# Altium schematic sheet ScintillatorCircuit.SchDoc
size A4; SheetNumber: 3; SheetTotal: 3
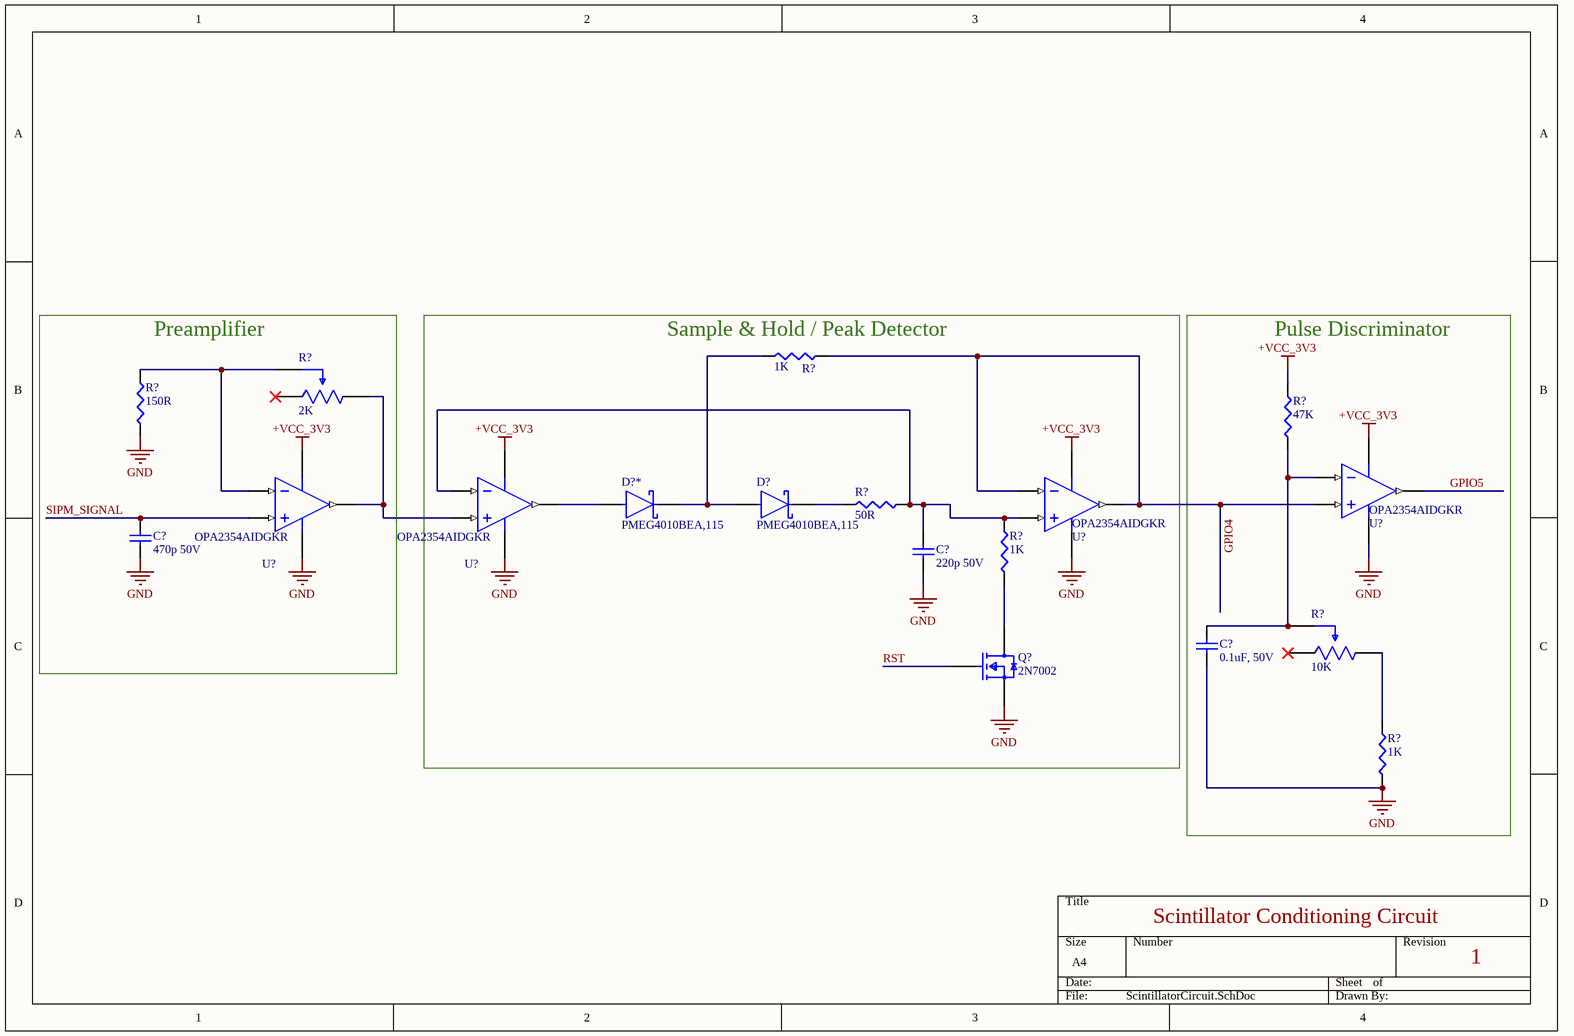
[diagram p0: ScintillatorCircuit.SchDoc]

## Parts
(Parts that share a designator on the sheet are numbered #1, #2 ... from top to bottom, then left to right.)
C?#1  470p 50V
C?#2  220p 50V
C?#3  0.1uF, 50V
D?  PMEG4010BEA,115
D?*  PMEG4010BEA,115
Q?  2N7002
R?#1  1K
R?#2  2K
R?#3  150R
R?#4  47K
R?#5  50R
R?#6  1K
R?#7  10K
R?#8  1K
U?#1  OPA2354AIDGKR
U?#2  OPA2354AIDGKR
U?#3  OPA2354AIDGKR
U?#4  OPA2354AIDGKR

## Blocks framed on the sheet
Preamplifier: C?#1 R?#2 R?#3 U?#2
Sample & Hold / Peak Detector: C?#2 D? D?* Q? R?#1 R?#5 R?#6 U?#3 U?#4
Pulse Discriminator: C?#3 R?#4 R?#7 R?#8 U?#1

## Nets
+VCC_3V3: R?#4.2 U?#1.8(V+) U?#2.8(V+) U?#3.8(V+) U?#4.8(V+)
GND: C?#1.1 C?#2.1 C?#3.1 Q?.2(S) R?#3.1 R?#8.1 U?#1.4(V-) U?#2.4(V-) U?#3.4(V-) U?#4.4(V-)
GPIO4: R?#1.2 U?#1.3(IN_A+) U?#4.1(OUT_A) U?#4.2(IN_A-)
GPIO5: U?#1.1(OUT_A)
RST: Q?.1(G)
SIPM_SIGNAL: C?#1.2 U?#2.3(IN_A+)
NetC?#2_2: C?#2.2 R?#5.2 R?#6.2 U?#3.2(IN_A-) U?#4.3(IN_A+)
NetC?#3_2: C?#3.2 R?#4.1 R?#7.2(WIPER) U?#1.2(IN_A-)
NetD?*_2: D?*.2(A) U?#3.1(OUT_A)
NetD?_1: D?.1(C) R?#5.1
NetD?_2: D?.2(A) D?*.1(C) R?#1.1
NetQ?_3: Q?.3(D) R?#6.1
NetR?#2_2: R?#2.2(WIPER) R?#3.2 U?#2.2(IN_A-)
NetR?#2_3: R?#2.3(CW) U?#2.1(OUT_A) U?#3.3(IN_A+)
NetR?#7_3: R?#7.3(CW) R?#8.2

Not connected (* = marked no-connect by the designer): R?#2 1(CCW)*; R?#7 1(CCW)*

## Notes on the sheet
- Scintillator Conditioning Circuit
- 1

## Library data of the parts
C?#1 = CL05B471KB5VPNC: CAP CER 470PF 50V X7R 0402; Manufacturer: Samsung; Dielectric Material: Ceramic; Multilayer: Yes; Tolerance  (fill in as +-): 10%; Reference Standard: AEC-Q200; Supplier: Digikey; Supplier Part Number: 1276-6586-1-ND; Manufacturer Part Number: CL05B471KB5VPNC; RoHS: Yes; Category: Ceramic Capacitors; Stock: 5716; Pricing: 1=0,1, 10=0,031, 100=0,0179, 1000=0,01119, 2500=0,00885, 5000=0,00853 (USD); Mounting Technology: Surface Mount; Pins: 2; Package Shape: Rectangular; Case/Package: 0402; Terminal Finish: Nickel; Min Operating Temperature: -55°C; Max Operating Temperature: 125°C; JESD-609 Code: e3; Value: 470pF; Capacitor Type: Ceramic; Packaging: Tape and Reel; Tolerance (fill in as +-): 10%; Rated DC Voltage (URdc): 50V; Temperature Characteristics Code: X7R; Termination: Wraparound; Reach SVHC Compliant: Yes; RoHS Compliant: Yes; ComponentLink1URL: https://datasheet.ciiva.com:443/pdfs/VipMasterIC/IC/SEMS/SEMS-S-A0005596039/SEMS-S-A0005588397-1.pdf?src-supplier=IHS+Markit; ComponentLink1Description: https://datasheet.ciiva.com:443/pdfs/VipMasterIC/IC/SEMS/SEMS-S-A0005596039/SEMS-S-A0005588397-1.pdf?src-supplier=IHS+Markit; ComponentLink2URL: http://www.samsungsem.com/kr/support/product-search/mlcc/CL05B471KB5VPNC.jsp?src-supplier=Digikey; ComponentLink2Description: http://www.samsungsem.com/kr/support/product-search/mlcc/CL05B471KB5VPNC.jsp?src-supplier=Digikey; ComponentLink3URL: http://www.samsungsem.com/servlet/FileDownload?type=spec&file=CL05B471KB5VPNC.pdf&src-supplier=Avnet; ComponentLink3Description: http://www.samsungsem.com/servlet/FileDownload?type=spec&file=CL05B471KB5VPNC.pdf&src-supplier=Avnet; ComponentLink4URL: https://datasheet.octopart.com/CL05B471KB5VPNC-Samsung-Electro-Mechanics-datasheet-110326788.pdf?src-supplier=Future+Electronics; ComponentLink4Description: https://datasheet.octopart.com/CL05B471KB5VPNC-Samsung-Electro-Mechanics-datasheet-110326788.pdf?src-supplier=Future+Electronics; LCSC Part Number: C472438
C?#2 = CL05B221KB5NNNC: CAP CER 220PF 50V X7R 0402; Manufacturer: Samsung; Dielectric Material: Ceramic; Multilayer: Yes; Tolerance  (fill in as +-): 10%; Supplier: Digikey; Supplier Part Number: 1276-1531-1-ND; Manufacturer Part Number: CL05B221KB5NNNC; RoHS: Yes; Category: Ceramic Capacitors; Stock: 59270; Pricing: 1=0,1, 10=0,019, 100=0,0104, 1000=0,00621, 2500=0,00466, 5000=0,00442 (USD); Mounting Technology: Surface Mount; Pins: 2; Package Shape: Rectangular; Case/Package: 0402; Terminal Finish: Nickel; Min Operating Temperature: -55°C; Max Operating Temperature: 125°C; JESD-609 Code: e3; Value: 220pF; Capacitor Type: Ceramic; Package Style: SMTMeter; Packaging: Tape and Reel; Tolerance (fill in as +-): 10%; Rated DC Voltage (URdc): 50V; Temperature Characteristics Code: X7R; Termination: Wraparound; Length: 1mm; Width: 0.5mm; Height: 0.55mm; Reach SVHC Compliant: Yes; RoHS Compliant: Yes; ComponentLink1URL: https://datasheet.ciiva.com:443/pdfs/VipMasterIC/IC/SEMS/SEMS-S-A0008384515/SEMS-S-A0008872887-1.pdf?src-supplier=IHS+Markit; ComponentLink1Description: https://datasheet.ciiva.com:443/pdfs/VipMasterIC/IC/SEMS/SEMS-S-A0008384515/SEMS-S-A0008872887-1.pdf?src-supplier=IHS+Markit; ComponentLink2URL: https://datasheet.ciiva.com/25806/cl05b221kb5nnnc-25806724.pdf?src-supplier=Digikey; ComponentLink2Description: https://datasheet.ciiva.com/25806/cl05b221kb5nnnc-25806724.pdf?src-supplier=Digikey; ComponentLink3URL: https://datasheet.ciiva.com/26838/getdatasheetpartid-359684-26838219.pdf?src-supplier=Verical; ComponentLink3Description: https://datasheet.ciiva.com/26838/getdatasheetpartid-359684-26838219.pdf?src-supplier=Verical; ComponentLink4URL: https://datasheet.ciiva.com/16449/cl05b221kb5nnnc-16449133.pdf?src-supplier=Future+Electronics; ComponentLink4Description: https://datasheet.ciiva.com/16449/cl05b221kb5nnnc-16449133.pdf?src-supplier=Future+Electronics; ComponentLink5URL: https://datasheet.ciiva.com/26309/mlcc-catalogdownload2013-eng-26309018.pdf?src-supplier=Distrelec; ComponentLink5Description: https://datasheet.ciiva.com/26309/mlcc-catalogdownload2013-eng-26309018.pdf?src-supplier=Distrelec; LCSC Part Number: C296710
C?#3 = CL05B104KB5NNNC: CAP CER 0.1UF 50V X7R 0402; Manufacturer: Samsung; Dielectric Material: Ceramic; Value: 100nF; Multilayer: Yes; Tolerance  (fill in as +-): 10%; Supplier: Avnet; Supplier Part Number: CL05B104KB5NNNC; Manufacturer Part Number: CL05B104KB5NNNC; RoHS: Yes; Category: Ceramic Capacitors; Pricing: 100000=0,00598, 120000=0,00595, 220000=0,00592, 500000=0,00589, 1000000=0,00586 (USD); Mounting Technology: Surface Mount; Pins: 2; Package Shape: Rectangular; Case/Package: 0402; Terminal Finish: Nickel; Min Operating Temperature: -55°C; Max Operating Temperature: 125°C; JESD-609 Code: e3; Capacitor Type: Ceramic; Packaging: Tape and Reel; Tolerance (fill in as +-): 10%; Rated DC Voltage (URdc): 50V; Temperature Characteristics Code: X7R; Termination: Wraparound; Reach SVHC Compliant: Yes; RoHS Compliant: Yes; ComponentLink1URL: https://datasheet.ciiva.com:443/pdfs/VipMasterIC/IC/SEMS/SEMS-S-A0008523115/SEMS-S-A0008523176-1.pdf?src-supplier=IHS+Markit; ComponentLink1Description: https://datasheet.ciiva.com:443/pdfs/VipMasterIC/IC/SEMS/SEMS-S-A0008523115/SEMS-S-A0008523176-1.pdf?src-supplier=IHS+Markit; ComponentLink2URL: https://datasheet.octopart.com/CL05B104KB5NNNC-Samsung-datasheet-97040617.pdf?src-supplier=Future+Electronics; ComponentLink2Description: https://datasheet.octopart.com/CL05B104KB5NNNC-Samsung-datasheet-97040617.pdf?src-supplier=Future+Electronics; ComponentLink3URL: https://datasheet.octopart.com/CL05B104KB5NNNC-Samsung-datasheet-8326407.pdf?src-supplier=TME; ComponentLink3Description: https://datasheet.octopart.com/CL05B104KB5NNNC-Samsung-datasheet-8326407.pdf?src-supplier=TME; LCSC Part Number: C960916
D? D?* = PMEG4010BEA,115: DIODE SCHOTTKY 40V 1A SOD323; Manufacturer: Nexperia; Diode Element Material: SILICON; Package Body Material: Plastic; Diode Type: RECTIFIER; Number of Elements: 1; Time @ Peak Reflow Temperature-Max (s): 40s; Qualification Status: Not Qualified; Supplier: Digikey; Supplier Part Number: 1727-5211-1-ND; Manufacturer Part Number: PMEG4010BEA,115; RoHS: Yes; Category: Schottky Diodes; Stock: 84260; Pricing: 1=0,29, 10=0,171, 100=0,109, 500=0,09678, 1000=0,08581 (USD); Pins: 2; Package Shape: Rectangular; Terminal Finish: Tin; Max Operating Temperature: 150°C; JESD-609 Code: e3; JESD-30 Code: R-PDSO-G2; Moisture Sensitivity Level: 1; Max Output current: 1A; Package Style: SMALL OUTLINEMeter; Peak Reflow Temperature (Cel): 260°C; Surface Mount: Yes; Technology: SCHOTTKY; Terminal Form: Gull Wing; Terminal Position: DUAL; Reach SVHC Compliant: Yes; RoHS Compliant: Yes; ComponentLink1URL: https://datasheet.ciiva.com:443/pdfs/VipMasterIC/IC/PHGL/PHGLS19535/PHGLS19689-1.pdf?src-supplier=IHS+Markit; ComponentLink1Description: https://datasheet.ciiva.com:443/pdfs/VipMasterIC/IC/PHGL/PHGLS19535/PHGLS19689-1.pdf?src-supplier=IHS+Markit; ComponentLink2URL: http://www.farnell.com/datasheets/689588.pdf?src-supplier=Farnell; ComponentLink2Description: http://www.farnell.com/datasheets/689588.pdf?src-supplier=Farnell; ComponentLink3URL: https://datasheet.octopart.com/PMEG4010BEA%2C115-Nexperia-datasheet-142110124.pdf?src-supplier=Future+Electronics; ComponentLink3Description: https://datasheet.octopart.com/PMEG4010BEA%2C115-Nexperia-datasheet-142110124.pdf?src-supplier=Future+Electronics; ComponentLink4URL: https://datasheet.octopart.com/PMEG4010BEA%2C115-Nexperia-datasheet-180924740.pdf?src-supplier=Newark; ComponentLink4Description: https://datasheet.octopart.com/PMEG4010BEA%2C115-Nexperia-datasheet-180924740.pdf?src-supplier=Newark; LCSC Part Number: C36975
Q? = 2N7002: MOSFET SOT23 N 60V 5OHM 150C; Manufacturer: ON Semiconductor / Fairchild; Package Body Material: Plastic; Transistor Element Material: SILICON; Polarity/Channel Type: N-CHANNEL; Drain Current-Max (ID): 115mA; Drain-source On Resistance-Max: 7.5R; Feedback Cap-Max (Crss): 5pF; FET Technology: METAL-OXIDE SEMICONDUCTOR; Number of Elements: 1; Operating Mode: ENHANCEMENT MODE; Power Dissipation-Max (Abs): 200mW; Transistor Application: SWITCHING; Qualification Status: Not Qualified; JEDEC-95 Code: TO-236AB; Supplier: Digikey; Supplier Part Number: 2N7002NCT-ND; Manufacturer Part Number: 2N7002; RoHS: Yes; Category: MOSFETs; Stock: 13333; Pricing: 1=0,49, 10=0,285, 100=0,1683, 500=0,16466, 1000=0,15124 (USD); Pins: 3; Package Shape: Rectangular; Terminal Finish: Tin; Max Operating Temperature: 150°C; JESD-609 Code: e3; DS Breakdown Voltage-Min: 60V; JESD-30 Code: R-PDSO-G3; Package Style: SMALL OUTLINEMeter; Surface Mount: Yes; Terminal Form: Gull Wing; Terminal Position: DUAL; Drain Current-Max (Abs) (ID): 115mA; Moisture Sensitivity Level: 1; RoHS Compliant: Yes; Reach SVHC Compliant: Yes; ComponentLink1URL: https://datasheet.ciiva.com:443/pdfs/VipMasterIC/IC/ONSM/ONSM-S-A0003544006/ONSM-S-A0003544006-1.pdf?src-supplier=IHS+Markit; ComponentLink1Description: https://datasheet.ciiva.com:443/pdfs/VipMasterIC/IC/ONSM/ONSM-S-A0003544006/ONSM-S-A0003544006-1.pdf?src-supplier=IHS+Markit; ComponentLink2URL: https://datasheet.ciiva.com/931/2n7000-931777.pdf?src-supplier=Farnell; ComponentLink2Description: https://datasheet.ciiva.com/931/2n7000-931777.pdf?src-supplier=Farnell; ComponentLink3URL: https://datasheet.ciiva.com/1254/2n7002-1254451.pdf?src-supplier=Newark; ComponentLink3Description: https://datasheet.ciiva.com/1254/2n7002-1254451.pdf?src-supplier=Newark; ComponentLink4URL: https://datasheet.ciiva.com/15137/getdatasheetpartid-93547-15137771.pdf?src-supplier=Verical; ComponentLink4Description: https://datasheet.ciiva.com/15137/getdatasheetpartid-93547-15137771.pdf?src-supplier=Verical; ComponentLink5URL: https://datasheet.ciiva.com/931/2n7000-931763.pdf?src-supplier=Digikey; ComponentLink5Description: https://datasheet.ciiva.com/931/2n7000-931763.pdf?src-supplier=Digikey; ComponentLink6URL: https://datasheet.ciiva.com/3304/nds7002a-3304381.pdf?src-supplier=Avnet; ComponentLink6Description: https://datasheet.ciiva.com/3304/nds7002a-3304381.pdf?src-supplier=Avnet; ComponentLink7URL: https://datasheet.ciiva.com/1188/660093-1188361.pdf?src-supplier=Element14; ComponentLink7Description: https://datasheet.ciiva.com/1188/660093-1188361.pdf?src-supplier=Element14; ComponentLink8URL: https://datasheet.ciiva.com/931/2n7000-931762.pdf?src-supplier=Digikey; ComponentLink8Description: https://datasheet.ciiva.com/931/2n7000-931762.pdf?src-supplier=Digikey; ComponentLink9URL: https://datasheet.ciiva.com/1254/660093-1254452.pdf?src-supplier=Newark; ComponentLink9Description: https://datasheet.ciiva.com/1254/660093-1254452.pdf?src-supplier=Newark; ComponentLink10URL: https://datasheet.ciiva.com/17007/2n7002-17007243.pdf?src-supplier=Future+Electronics; ComponentLink10Description: https://datasheet.ciiva.com/17007/2n7002-17007243.pdf?src-supplier=Future+Electronics; ComponentLink11URL: https://datasheet.ciiva.com/22655/660093-22655230.pdf?src-supplier=Element14; ComponentLink11Description: https://datasheet.ciiva.com/22655/660093-22655230.pdf?src-supplier=Element14; LCSC Part Number: C124475
R?#1 R?#6 R?#8 = AC0402JR-071KL: RES SMD 1K OHM 5% 1/16W 0402; Manufacturer: Yageo; Additional Feature: LASER TRIMMABLE; Power: 62.5mW; Rated Temperature: 70°C; Value: 1kR; Working Voltage: 50V; Temperature Coefficient (ppm/Cel): 100; Package Height: 0.32mm; Package Length: 1mm; Package Width: 0.5mm; Reference Standard: AEC-Q200; Supplier: Digikey; Supplier Part Number: YAG3525CT-ND; Manufacturer Part Number: AC0402JR-071KL; RoHS: Yes; Category: Chip SMD Resistors; Stock: 135341; Pricing: 1=0,1, 10=0,007, 50=0,0066, 100=0,0061, 500=0,0051, 1000=0,00408 (USD); Mounting Technology: Surface Mount; Pins: 2; Package Shape: Rectangular; Case/Package: 0402; Terminal Finish: Nickel; Min Operating Temperature: -55°C; Max Operating Temperature: 155°C; Tolerance: 5%; JESD-609 Code: e3; Termination: Wraparound; Resistor Type: FIXED RESISTOR; Construction: Chip; Packaging: Tape and Reel; Technology: METAL GLAZE/THICK FILM; Reach SVHC Compliant: Yes; RoHS Compliant: Yes; ComponentLink1URL: https://datasheet.ciiva.com:443/pdfs/VipMasterIC/IC/YAGO/YAGO-S-A0003597364/YAGO-S-A0003597364-1.pdf?src-supplier=IHS+Markit; ComponentLink1Description: https://datasheet.ciiva.com:443/pdfs/VipMasterIC/IC/YAGO/YAGO-S-A0003597364/YAGO-S-A0003597364-1.pdf?src-supplier=IHS+Markit; ComponentLink2URL: https://datasheet.ciiva.com/12577/pyu-ac-51-rohs-l-2-12577195.pdf?src-supplier=Mouser; ComponentLink2Description: https://datasheet.ciiva.com/12577/pyu-ac-51-rohs-l-2-12577195.pdf?src-supplier=Mouser; LCSC Part Number: C138287
R?#2 = 3314J-1-202E: TRIMMER 2K OHM 0.25W J LEAD TOP; Manufacturer: Bourns; Tolerance: 20%; Actuator Orientation: Vertical; Actuator Type: SCREW; Number of Turns: 1; Power: 250mW; Rated Temperature: 70°C; Value: 2kR; Resistance Law: Linear; Rotational Angle: 240°; Temperature Coefficient (ppm/Cel): -100,100; Package Height: 2.55mm; Package Length: 5mm; Package Width: 4.5mm; Supplier: Digikey; Supplier Part Number: 3314J-202ECT-ND; Manufacturer Part Number: 3314J-1-202E; RoHS: Yes; Category: Variable Resistors and Potentiometers; Stock: 7573; Pricing: 1=1,58, 10=1,335, 100=1,1219 (USD); Mounting Technology: Surface Mount; Pins: 3; Package Shape: Rectangular; Case/Package: 2018; Terminal Finish: Tin; Min Operating Temperature: -55°C; Max Operating Temperature: 125°C; JESD-609 Code: e3; Resistor Type: TRIMMER; Construction: Rectangular; Packaging: Tape and Reel; Technology: CERMET; Termination: J BEND; Reach SVHC Compliant: Yes; RoHS Compliant: Yes; ComponentLink1URL: https://datasheet.ciiva.com:443/pdfs/VipMasterIC/IC/BOUR/BOUR-S-A0008818047/BOUR-S-A0008818047-1.pdf?src-supplier=IHS+Markit; ComponentLink1Description: https://datasheet.ciiva.com:443/pdfs/VipMasterIC/IC/BOUR/BOUR-S-A0008818047/BOUR-S-A0008818047-1.pdf?src-supplier=IHS+Markit; ComponentLink2URL: https://datasheet.ciiva.com/6197/1770665-6197457.pdf?src-supplier=Farnell; ComponentLink2Description: https://datasheet.ciiva.com/6197/1770665-6197457.pdf?src-supplier=Farnell; ComponentLink3URL: https://datasheet.ciiva.com/11831/0900766b800302ec-11831929.pdf?src-supplier=Rs; ComponentLink3Description: https://datasheet.ciiva.com/11831/0900766b800302ec-11831929.pdf?src-supplier=Rs; ComponentLink4URL: https://datasheet.ciiva.com/2156/3314-2156300.pdf?src-supplier=Digikey; ComponentLink4Description: https://datasheet.ciiva.com/2156/3314-2156300.pdf?src-supplier=Digikey; ComponentLink5URL: https://datasheet.ciiva.com/2156/3314-2156301.pdf?src-supplier=Digikey; ComponentLink5Description: https://datasheet.ciiva.com/2156/3314-2156301.pdf?src-supplier=Digikey; ComponentLink6URL: https://datasheet.ciiva.com/2156/3314-2156302.pdf?src-supplier=Digikey; ComponentLink6Description: https://datasheet.ciiva.com/2156/3314-2156302.pdf?src-supplier=Digikey; ComponentLink7URL: https://datasheet.ciiva.com/3266/3314-3266277.pdf?src-supplier=Avnet; ComponentLink7Description: https://datasheet.ciiva.com/3266/3314-3266277.pdf?src-supplier=Avnet; ComponentLink8URL: https://datasheet.ciiva.com/30098/6393314-30098281.pdf?src-supplier=Onlinecomponents.com; ComponentLink8Description: https://datasheet.ciiva.com/30098/6393314-30098281.pdf?src-supplier=Onlinecomponents.com; ComponentLink9URL: https://datasheet.ciiva.com/1477/1846253-1477628.pdf?src-supplier=Element14; ComponentLink9Description: https://datasheet.ciiva.com/1477/1846253-1477628.pdf?src-supplier=Element14; ComponentLink10URL: https://datasheet.ciiva.com/22696/1846253-22696687.pdf?src-supplier=Element14; ComponentLink10Description: https://datasheet.ciiva.com/22696/1846253-22696687.pdf?src-supplier=Element14; ComponentLink11URL: https://datasheet.ciiva.com/48698/001055052-da-01-en-smd-trimm-3314j-1-202e-2k-ohm-0-25w-48698971.pdf?src-supplier=Conrad; ComponentLink11Description: https://datasheet.ciiva.com/48698/001055052-da-01-en-smd-trimm-3314j-1-202e-2k-ohm-0-25w-48698971.pdf?src-supplier=Conrad; LCSC Part Number: C94513
R?#3 = AC0402FR-07150RL: RES SMD 150 OHM 1% 1/16W 0402; Manufacturer: Yageo; Additional Feature: LASER TRIMMABLE; Power: 62.5mW; Rated Temperature: 70°C; Working Voltage: 50V; Temperature Coefficient (ppm/Cel): 100; Package Height: 0.32mm; Package Length: 1mm; Package Width: 0.5mm; Reference Standard: AEC-Q200; Supplier: Digikey; Supplier Part Number: YAG3443DKR-ND; Manufacturer Part Number: AC0402FR-07150RL; Category: Chip SMD Resistors; Stock: 72156; Pricing: 1=0,1, 10=0,009, 100=0,0071, 1000=0,00612, 2500=0,0051, 5000=0,00407 (USD); Mounting Technology: Surface Mount; Pins: 2; Package Shape: Rectangular; Case/Package: 0402; Terminal Finish: Nickel; Min Operating Temperature: -55°C; Max Operating Temperature: 155°C; Tolerance: 1%; JESD-609 Code: e3; Resistor Type: FIXED RESISTOR; Construction: Chip; Packaging: Tape and Reel; Value: 150R; Technology: METAL GLAZE/THICK FILM; Termination: Wraparound; Reach SVHC Compliant: Yes; RoHS Compliant: Yes; ComponentLink1URL: https://datasheet.ciiva.com:443/pdfs/VipMasterIC/IC/YAGO/YAGO-S-A0003597364/YAGO-S-A0003597364-1.pdf?src-supplier=IHS+Markit; ComponentLink1Description: https://datasheet.ciiva.com:443/pdfs/VipMasterIC/IC/YAGO/YAGO-S-A0003597364/YAGO-S-A0003597364-1.pdf?src-supplier=IHS+Markit; ComponentLink2URL: https://datasheet.ciiva.com/12576/pyu-ac-51-rohs-l-2-12576540.pdf?src-supplier=Mouser; ComponentLink2Description: https://datasheet.ciiva.com/12576/pyu-ac-51-rohs-l-2-12576540.pdf?src-supplier=Mouser; ComponentLink3URL: https://datasheet.octopart.com/AC0402FR-07150RL-Yageo-datasheet-83209224.pdf?src-supplier=Upverter; ComponentLink3Description: https://datasheet.octopart.com/AC0402FR-07150RL-Yageo-datasheet-83209224.pdf?src-supplier=Upverter; ComponentLink4URL: https://datasheet.octopart.com/AC0402FR-07150RL-Yageo-datasheet-178509465.pdf?src-supplier=Farnell; ComponentLink4Description: https://datasheet.octopart.com/AC0402FR-07150RL-Yageo-datasheet-178509465.pdf?src-supplier=Farnell; ComponentLink5URL: https://datasheet.octopart.com/AC0402FR-07150RL-Yageo-datasheet-12512238.pdf; ComponentLink5Description: https://datasheet.octopart.com/AC0402FR-07150RL-Yageo-datasheet-12512238.pdf; ComponentLink6URL: https://datasheet.octopart.com/AC0402FR-07150RL-Yageo-datasheet-166720450.pdf?src-supplier=Future+Electronics; ComponentLink6Description: https://datasheet.octopart.com/AC0402FR-07150RL-Yageo-datasheet-166720450.pdf?src-supplier=Future+Electronics; ComponentLink7URL: https://datasheet.octopart.com/AC0402FR-07150RL-Yageo-datasheet-151884373.pdf?src-supplier=Future+Electronics; ComponentLink7Description: https://datasheet.octopart.com/AC0402FR-07150RL-Yageo-datasheet-151884373.pdf?src-supplier=Future+Electronics; ComponentLink8URL: https://datasheet.octopart.com/AC0402FR-07150RL-Yageo-datasheet-137699919.pdf?src-supplier=Future+Electronics; ComponentLink8Description: https://datasheet.octopart.com/AC0402FR-07150RL-Yageo-datasheet-137699919.pdf?src-supplier=Future+Electronics; ComponentLink9URL: https://datasheet.octopart.com/AC0402FR-07150RL-Yageo-datasheet-24580492.pdf?src-supplier=Future+Electronics; ComponentLink9Description: https://datasheet.octopart.com/AC0402FR-07150RL-Yageo-datasheet-24580492.pdf?src-supplier=Future+Electronics; ComponentLink10URL: https://datasheet.octopart.com/AC0402FR-07150RL-Yageo-datasheet-13029202.pdf?src-supplier=Future+Electronics; ComponentLink10Description: https://datasheet.octopart.com/AC0402FR-07150RL-Yageo-datasheet-13029202.pdf?src-supplier=Future+Electronics; ComponentLink11URL: https://datasheet.octopart.com/AC0402FR-07150RL-Yageo-datasheet-140571090.pdf?src-supplier=Arrow.cn; ComponentLink11Description: https://datasheet.octopart.com/AC0402FR-07150RL-Yageo-datasheet-140571090.pdf?src-supplier=Arrow.cn; LCSC Part Number: C226790
R?#4 = AC0402FR-0747KL: RES SMD 47K OHM 1% 1/16W 0402; Manufacturer: Yageo; Additional Feature: LASER TRIMMABLE; Power: 62.5mW; Rated Temperature: 70°C; Value: 47kR; Working Voltage: 50V; Temperature Coefficient (ppm/Cel): 100; Package Height: 0.32mm; Package Length: 1mm; Package Width: 0.5mm; Reference Standard: AEC-Q200; Supplier: Digikey; Supplier Part Number: YAG3490CT-ND; Manufacturer Part Number: AC0402FR-0747KL; RoHS: Yes; Category: Chip SMD Resistors; Stock: 187655; Pricing: 1=0,1, 10=0,011, 100=0,0082, 1000=0,00612, 2500=0,0051, 5000=0,00407 (USD); Mounting Technology: Surface Mount; Pins: 2; Package Shape: Rectangular; Case/Package: 0402; Terminal Finish: Nickel; Min Operating Temperature: -55°C; Max Operating Temperature: 155°C; Tolerance: 1%; JESD-609 Code: e3; Resistor Type: FIXED RESISTOR; Construction: Chip; Packaging: Tape and Reel; Technology: METAL GLAZE/THICK FILM; Termination: Wraparound; Reach SVHC Compliant: Yes; RoHS Compliant: Yes; ComponentLink1URL: https://datasheet.ciiva.com:443/pdfs/VipMasterIC/IC/YAGO/YAGO-S-A0003597364/YAGO-S-A0003597364-1.pdf?src-supplier=IHS+Markit; ComponentLink1Description: https://datasheet.ciiva.com:443/pdfs/VipMasterIC/IC/YAGO/YAGO-S-A0003597364/YAGO-S-A0003597364-1.pdf?src-supplier=IHS+Markit; ComponentLink2URL: https://datasheet.ciiva.com/12576/pyu-ac-51-rohs-l-2-12576549.pdf?src-supplier=Mouser; ComponentLink2Description: https://datasheet.ciiva.com/12576/pyu-ac-51-rohs-l-2-12576549.pdf?src-supplier=Mouser; LCSC Part Number: C144757
R?#5 = RT0402BRE0750RL: RES SMD 50 OHM 0.1% 1/16W 0402; Manufacturer: Yageo; Additional Feature: LASER TRIMMABLE; Power: 62.5mW; Rated Temperature: 70°C; Working Voltage: 50V; Temperature Coefficient (ppm/Cel): 50; Supplier: Digikey; Supplier Part Number: 13-RT0402BRE0750RLCT-ND; Manufacturer Part Number: RT0402BRE0750RL; RoHS: Yes; Category: Chip SMD Resistors; Stock: 6180; Pricing: 1=0,18, 10=0,133, 50=0,1072, 100=0,0959, 500=0,0765, 1000=0,06834, 5000=0,05406 (USD); Mounting Technology: Surface Mount; Pins: 2; Package Shape: Rectangular; Case/Package: 0402; Min Operating Temperature: -55°C; Max Operating Temperature: 155°C; Tolerance: 0.1%; Resistor Type: FIXED RESISTOR; Packaging: Tape and Reel; Value: 50R; Technology: THIN FILM; Termination: Wraparound; Reach SVHC Compliant: Yes; RoHS Compliant: Yes; ComponentLink1URL: https://datasheet.ciiva.com:443/pdfs/VipMasterIC/IC/YAGO/YAGO-S-A0003507815/YAGO-S-A0003507815-1.pdf?src-supplier=IHS+Markit; ComponentLink1Description: https://datasheet.ciiva.com:443/pdfs/VipMasterIC/IC/YAGO/YAGO-S-A0003507815/YAGO-S-A0003507815-1.pdf?src-supplier=IHS+Markit; ComponentLink2URL: http://www.yageo.com/documents/recent/PYu-RT_1-to-0.01_RoHS_L_9.pdf?src-supplier=Digikey; ComponentLink2Description: http://www.yageo.com/documents/recent/PYu-RT_1-to-0.01_RoHS_L_9.pdf?src-supplier=Digikey; ComponentLink3URL: https://datasheet.octopart.com/RT0402BRE0750RL-Yageo-datasheet-166250672.pdf?src-supplier=Future+Electronics; ComponentLink3Description: https://datasheet.octopart.com/RT0402BRE0750RL-Yageo-datasheet-166250672.pdf?src-supplier=Future+Electronics; ComponentLink4URL: https://datasheet.octopart.com/RT0402BRE0750RL-Yageo-datasheet-176402239.pdf?src-supplier=Farnell; ComponentLink4Description: https://datasheet.octopart.com/RT0402BRE0750RL-Yageo-datasheet-176402239.pdf?src-supplier=Farnell; ComponentLink5URL: https://datasheet.octopart.com/RT0402BRE0750RL-Yageo-datasheet-176402239.pdf?src-supplier=Element14; ComponentLink5Description: https://datasheet.octopart.com/RT0402BRE0750RL-Yageo-datasheet-176402239.pdf?src-supplier=Element14; LCSC Part Number: C853312
R?#7 = TS53YL103MR10: TRIMMER 10K OHM 0.25W GW TOP ADJ; Manufacturer: Vishay; Tolerance: 20%; Actuator Orientation: Vertical; Actuator Type: SCREW; Number of Turns: 1; Power: 250mW; Rated Temperature: 70°C; Value: 10kR; Resistance Law: Linear; Rotational Angle: 220°; Working Voltage: 50V; Temperature Coefficient (ppm/Cel): -100,100; Package Height: 2.7mm; Package Length: 5mm; Supplier: Digikey; Supplier Part Number: TS53YL-10KCT-ND; Manufacturer Part Number: TS53YL103MR10; RoHS: Yes; Category: Variable Resistors and Potentiometers; Stock: 947; Pricing: 1=2,72, 10=2,29, 100=1,9223 (USD); Mounting Technology: Surface Mount; Pins: 3; Package Shape: Rectangular; Case/Package: 2020; Terminal Finish: Tin; Min Operating Temperature: -55°C; Max Operating Temperature: 125°C; JESD-609 Code: e3; Resistor Type: TRIMMER; Construction: Trimmer; Packaging: Tape and Reel; Technology: CERMET; Termination: Gull Wing; Package Width: 5mm; Reach SVHC Compliant: Yes; RoHS Compliant: Yes; ComponentLink1URL: https://datasheet.ciiva.com:443/pdfs/VipMasterIC/IC/VISH/VISH-S-A0007084328/VISH-S-A0007084328-1.pdf?src-supplier=IHS+Markit; ComponentLink1Description: https://datasheet.ciiva.com:443/pdfs/VipMasterIC/IC/VISH/VISH-S-A0007084328/VISH-S-A0007084328-1.pdf?src-supplier=IHS+Markit; ComponentLink2URL: https://datasheet.ciiva.com/11831/0900766b80442f56-11831494.pdf?src-supplier=Rs; ComponentLink2Description: https://datasheet.ciiva.com/11831/0900766b80442f56-11831494.pdf?src-supplier=Rs; ComponentLink3URL: https://datasheet.ciiva.com/2156/ts53y-2156140.pdf?src-supplier=Digikey; ComponentLink3Description: https://datasheet.ciiva.com/2156/ts53y-2156140.pdf?src-supplier=Digikey; ComponentLink4URL: https://datasheet.ciiva.com/2156/ts53y-2156141.pdf?src-supplier=Digikey; ComponentLink4Description: https://datasheet.ciiva.com/2156/ts53y-2156141.pdf?src-supplier=Digikey; ComponentLink5URL: https://datasheet.ciiva.com/2156/ts53y-2156142.pdf?src-supplier=Digikey; ComponentLink5Description: https://datasheet.ciiva.com/2156/ts53y-2156142.pdf?src-supplier=Digikey; ComponentLink6URL: https://datasheet.ciiva.com/16716/70218802-16716550.pdf?src-supplier=Allied+Electronics; ComponentLink6Description: https://datasheet.ciiva.com/16716/70218802-16716550.pdf?src-supplier=Allied+Electronics; ComponentLink7URL: https://datasheet.ciiva.com/8021/1696501-8021141.pdf?src-supplier=Element14; ComponentLink7Description: https://datasheet.ciiva.com/8021/1696501-8021141.pdf?src-supplier=Element14; LCSC Part Number: C5189226
U?#1-U?#4 = OPA2354AIDGKR: IC OPAMP VFB 2 CIRCUIT 8VSSOP; Manufacturer: Texas Instruments; Package Body Material: Plastic; Bandwidth-Nom: 250MHz; Consumer IC Type: VIDEO AMPLIFIER; Number of Channels: 1; Channels: 2; Max Supply Voltage: 2.75V; Min Supply Voltage: 1.25V; Qualification Status: Not Qualified; Supplier: Digikey; Supplier Part Number: 296-12642-2-ND; Manufacturer Part Number: OPA2354AIDGKR; RoHS: Yes; Category: Amplifiers - Op Amps, Buffer, Instrumentation; Stock: 1940; Pricing: 2500=1,67764, 5000=1,64498 (USD); Case/Package: TSSOP; Pins: 8; Package Shape: Square; Terminal Finish: Nickel; Min Operating Temperature: -40°C; Max Operating Temperature: 125°C; JESD-609 Code: e4; JESD-30 Code: S-PDSO-G8; Moisture Sensitivity Level: 2; Package Style: SMALL OUTLINE, HEAT SINK/SLUG, THIN PROFILE, SHRINK PITCHMeter; Peak Reflow Temperature (Cel): 260°C; Surface Mount: Yes; Technology: CMOS; Terminal Form: Gull Wing; Terminal Position: DUAL; Length: 3mm; Width: 3mm; Height - Seated (Max): 1.1mm; Terminal Pitch: 0.65mm; Reach SVHC Compliant: Yes; RoHS Compliant: Yes; Temperature Grade: AUTOMOTIVE; ComponentLink1URL: https://www.ti.com:443/lit/ds/symlink/opa2354.pdf?src-supplier=IHS+Markit; ComponentLink1Description: https://www.ti.com:443/lit/ds/symlink/opa2354.pdf?src-supplier=IHS+Markit; ComponentLink2URL: https://datasheet.ciiva.com/1798/opa354-1798288.pdf?src-supplier=Digikey; ComponentLink2Description: https://datasheet.ciiva.com/1798/opa354-1798288.pdf?src-supplier=Digikey; ComponentLink3URL: https://datasheet.ciiva.com/23838/opa2354-23838874.pdf?src-supplier=Newark; ComponentLink3Description: https://datasheet.ciiva.com/23838/opa2354-23838874.pdf?src-supplier=Newark; ComponentLink4URL: https://datasheet.ciiva.com/1798/opa354-1798289.pdf?src-supplier=Digikey; ComponentLink4Description: https://datasheet.ciiva.com/1798/opa354-1798289.pdf?src-supplier=Digikey; ComponentLink5URL: https://datasheet.ciiva.com/1798/opa354-1798290.pdf?src-supplier=Digikey; ComponentLink5Description: https://datasheet.ciiva.com/1798/opa354-1798290.pdf?src-supplier=Digikey; ComponentLink6URL: https://datasheet.ciiva.com/14456/sbos233e-14456446.pdf?src-supplier=Avnet; ComponentLink6Description: https://datasheet.ciiva.com/14456/sbos233e-14456446.pdf?src-supplier=Avnet; LCSC Part Number: C95502